# EAGLE design LED_power-supply (EAGLE 6.4)
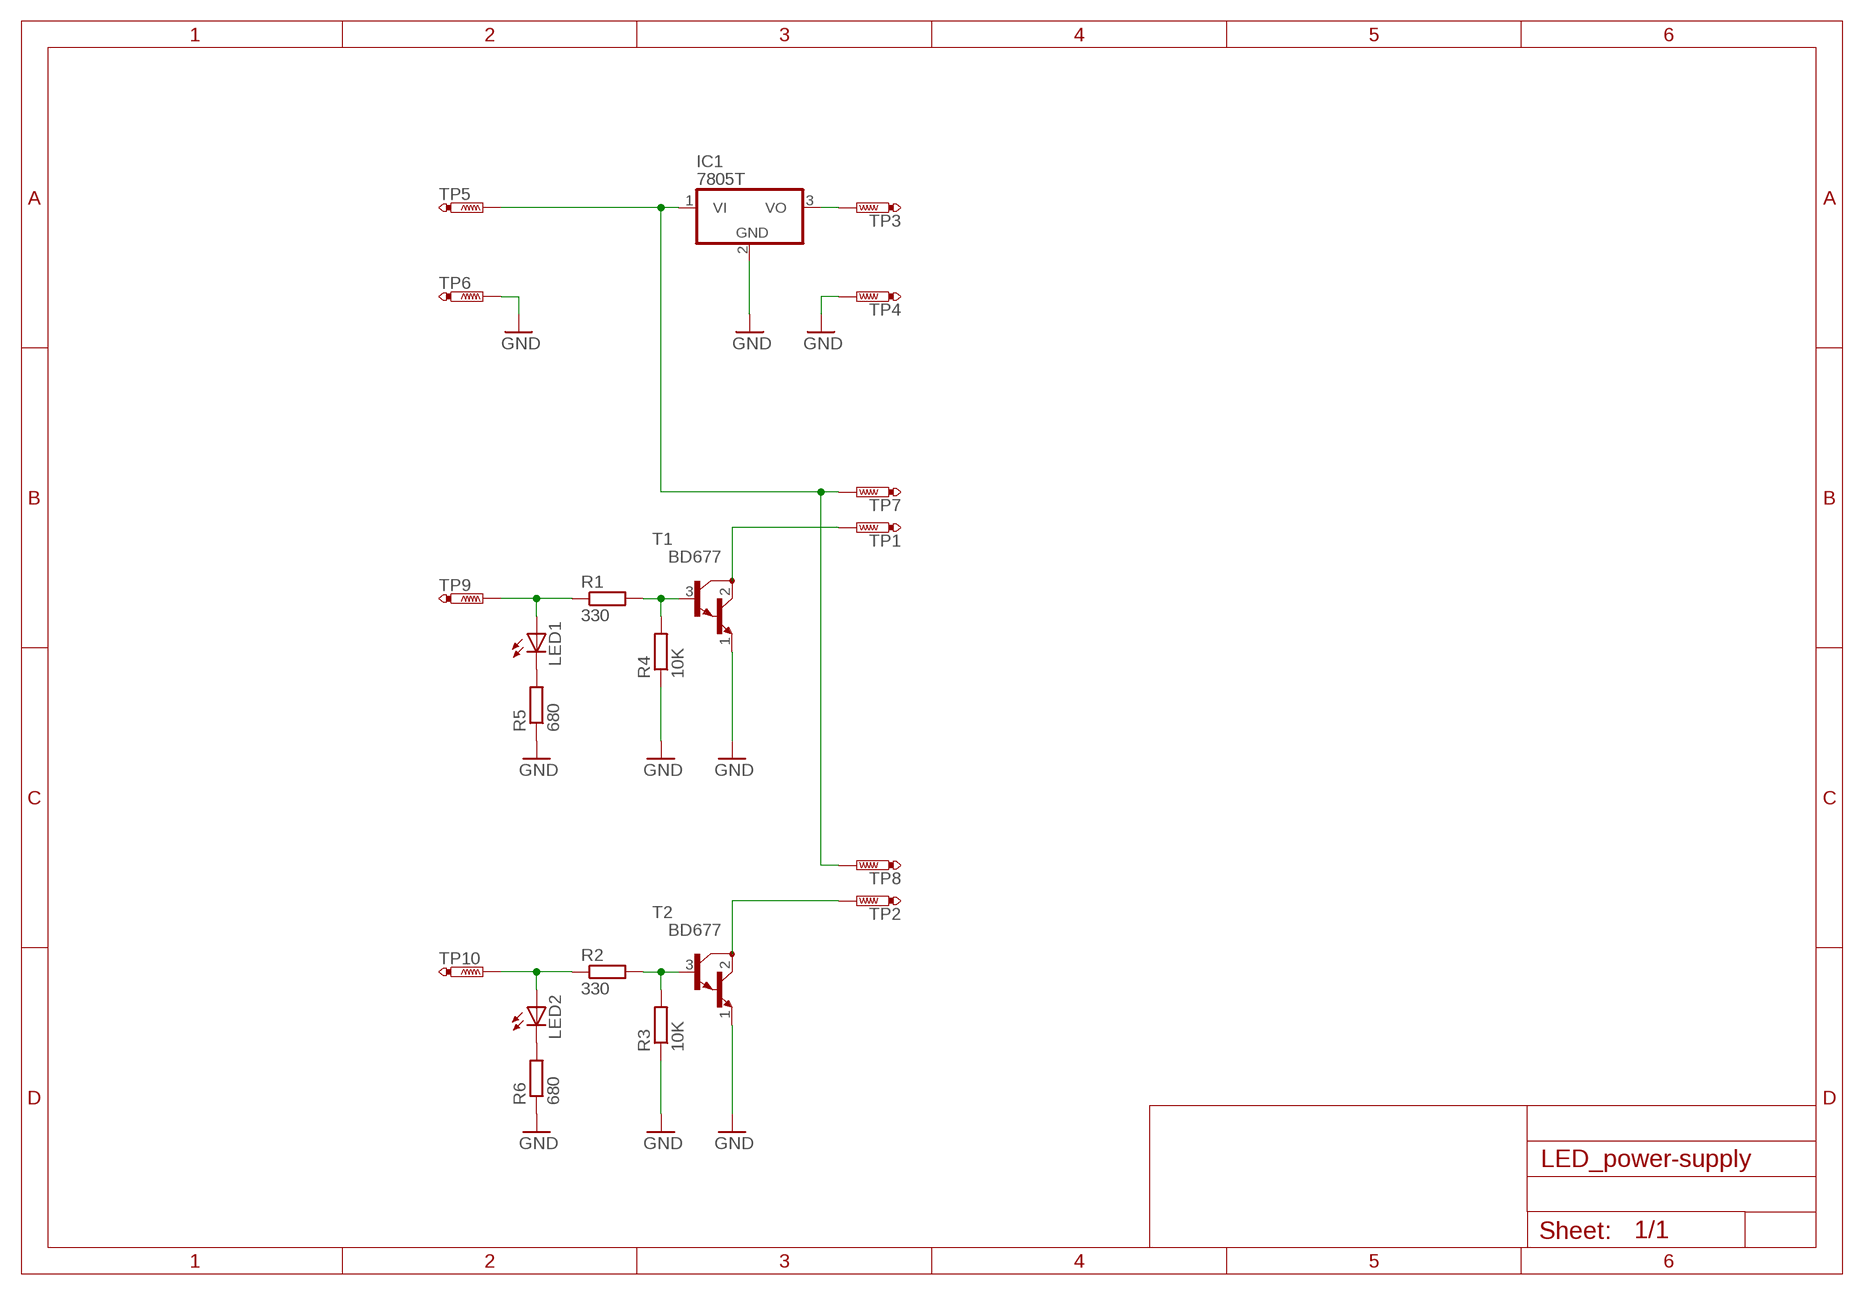
[diagram p0: schematic, sheet 1]

## Parts
IC1  7805T  [TO220H]
LED1  LED3MM  [LED3MM]
LED2  LED3MM  [LED3MM]
R1  330  R-EU_0207/10  [0207/10]
R2  330  R-EU_0207/10  [0207/10]
R3  10K  R-EU_0207/10  [0207/10]
R4  10K  R-EU_0207/10  [0207/10]
R5  680  R-EU_0207/10  [0207/10]
R6  680  R-EU_0207/10  [0207/10]
T1  BD677  [TO126]
T2  BD677  [TO126]
TP1  PTR1PAD1-17  [P1-17]
TP2  PTR1PAD1-17  [P1-17]
TP3  PTR1PAD1-17  [P1-17]
TP4  PTR1PAD1-17  [P1-17]
TP5  PTR1PAD1-17  [P1-17]
TP6  PTR1PAD1-17  [P1-17]
TP7  PTR1PAD1-17  [P1-17]
TP8  PTR1PAD1-17  [P1-17]
TP9  PTR1PAD1-17  [P1-17]
TP10  PTR1PAD1-17  [P1-17]

## Nets
GND: IC1.2(GND) R3.1 R4.1 R5.1 R6.1 T1.1(E) T2.1(E) TP4.TP TP6.TP
N$1: R1.2 R4.2 T1.3(B)
N$2: LED1.A R1.1 TP9.TP
N$3: T1.2(C) TP1.TP
N$4: R2.2 R3.2 T2.3(B)
N$5: LED2.A R2.1 TP10.TP
N$6: T2.2(C) TP2.TP
N$7: IC1.3(VO) TP3.TP
N$8: LED1.K(C) R5.2
N$9: IC1.1(VI) TP5.TP TP7.TP TP8.TP
N$10: LED2.K(C) R6.2

## Library data of the parts
IC1 = linear:78*: Positive VOLTAGE REGULATOR Source: http://cache.national.com/ds/LM/LM78L05.pdf http://www.fairchildsemi.com/ds/LM/LM7805.pdf
LED1 LED2 = led:LED: LED OSRAM: - CHIPLED LG R971, LG N971, LY N971, LG Q971, LY Q971, LO R971, LY R971 LH N974, LH R974 LS Q976, LO Q976, LY Q976 LO Q996 - Hyper CHIPLED LW Q18S LB Q993, LB Q99A, LB R99A - SideLED LS A670, LO A670, LY A670, LG A670, LP A670 LB A673, LV A673, LT A673, LW A673 LH A674 LY A675 LS A676, LA A676, LO A676, LY A676, LW A676 LS A679, LY A679, LG A679 - Hyper Micro SIDELED® LS Y876, LA Y876, LO Y876, LY Y876 LT Y87S - SmartLED LW L88C, LW L88S LB L89C, LB L89S, LG L890 LS L89K, LO L89K, LY L89K LS L896, LA L896, LO L896, LY L896 - TOPLED LS T670, LO T670, LY T670, LG T670, LP T670 LSG T670, LSP T670, LSY T670, LOP T670, LYG T670 LG T671, LOG T671, LSG T671 LB T673, LV T673, LT T673, LW T673 LH T674 LS T676, LA T676, LO T676, LY T676, LB T676, LH T676, LSB T676, LW T676 LB T67C, LV T67C, LT T67C, LS T67K, LO T67K, LY T67K, LW E67C LS E67B, LA E67B, LO E67B, LY E67B, LB E67C, LV E67C, LT E67C LW T67C LS T679, LY T679, LG T679 LS T770, LO T770, LY T770, LG T770, LP T770 LB T773, LV T773, LT T773, LW T773 LH T774 LS E675, LA E675, LY E675, LS T675 LS T776, LA T776, LO T776, LY T776, LB T776 LHGB T686 LT T68C, LB T68C - Hyper Mini TOPLED® LB M676 - Mini TOPLED Santana® LG M470 LS M47K, LO M47K, LY M47K Source: http://www.osram.convergy.de LUXEON: - LUMILED® LXK2-PW12-R00, LXK2-PW12-S00, LXK2-PW14-U00, LXK2-PW14-V00 LXK2-PM12-R00, LXK2-PM12-S00, LXK2-PM14-U00 LXK2-PE12-Q00, LXK2-PE12-R00, LXK2-PE12-S00, LXK2-PE14-T00, LXK2-PE14-U00 LXK2-PB12-K00, LXK2-PB12-L00, LXK2-PB12-M00, LXK2-PB14-N00, LXK2-PB14-P00, LXK2-PB14-Q00 LXK2-PR12-L00, LXK2-PR12-M00, LXK2-PR14-Q00, LXK2-PR14-R00 LXK2-PD12-Q00, LXK2-PD12-R00, LXK2-PD12-S00 LXK2-PH12-R00, LXK2-PH12-S00 LXK2-PL12-P00, LXK2-PL12-Q00, LXK2-PL12-R00 Source: www.luxeon.com KINGBRIGHT: KA-3528ASYC Source: www.kingbright.com
R1-R6 = rcl:R-EU_: RESISTOR, European symbol
T1 T2 = transistor:BD677: NPN BIPOLAR DARLINGTON TRANSISTOR
TP1-TP10 = testpad:PTR1: TEST PIN

## Board
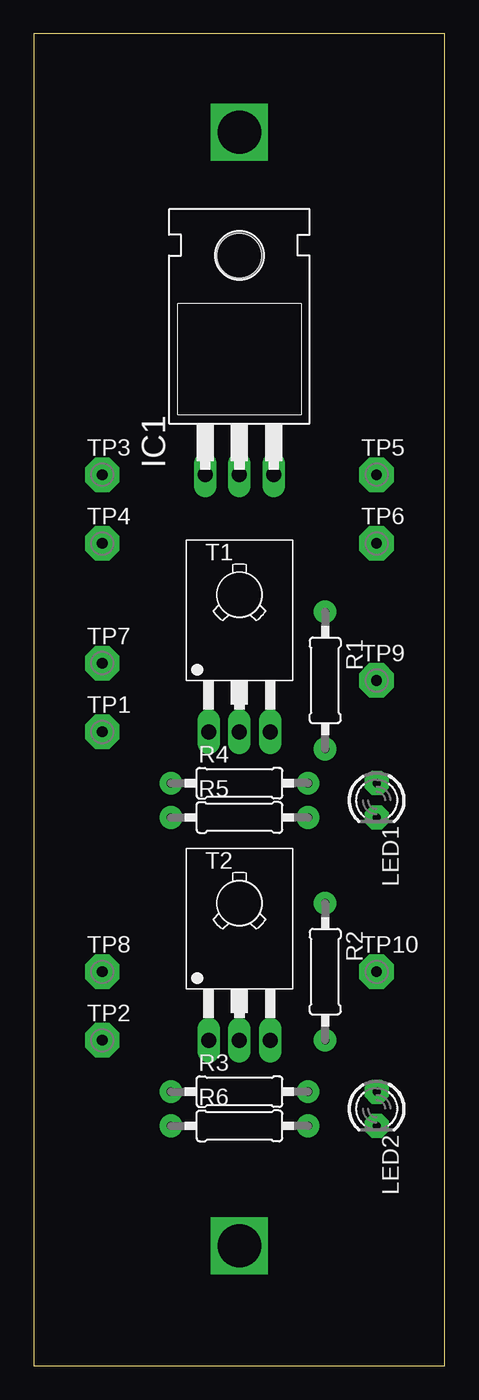
[diagram p1: board, top side]
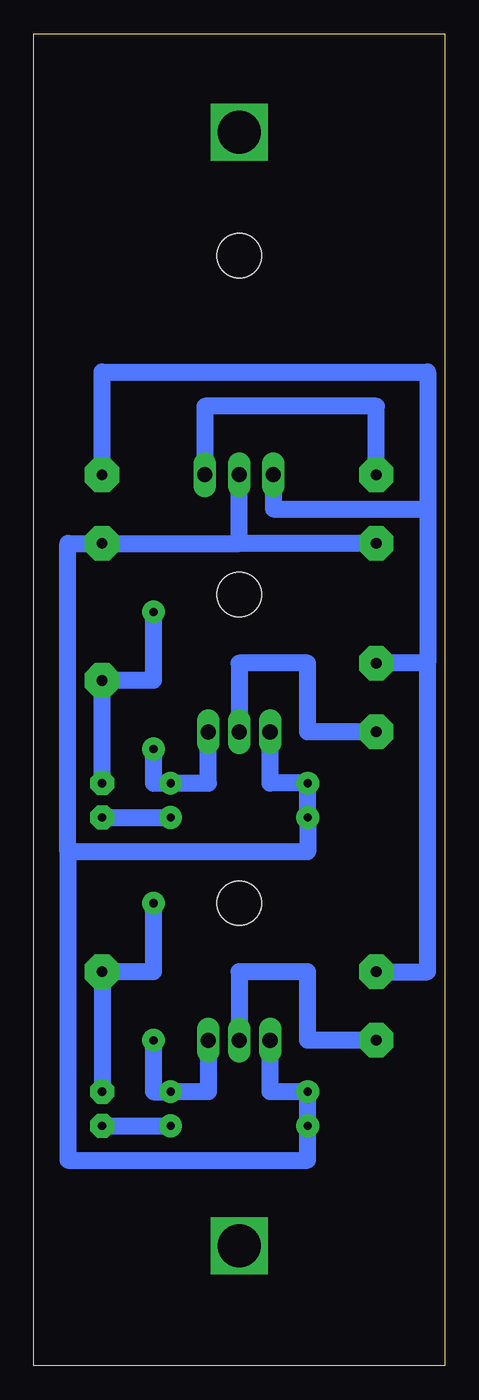
[diagram p2: board, bottom side, seen from below]

Size 30.46 x 98.73 mm. Coordinates in mm from the lower left corner, seen from the top.
Outline: 0,0 30.46,0 30.46,98.73 0,98.73 0,0
Copper layers (1*16): Top 0.035mm / dielectric 1.5mm / Bottom 0.035mm
Design rules "default": minimum track width 10mil, minimum drill 24mil, track to track 8mil, track to pad 8mil, pad to pad 8mil, via to via 8mil, smd to smd 8mil, copper to edge 40mil, drill to drill 8mil, minimum pad ring 10mil, minimum via ring 8mil, stop-mask expansion 4mil, vias tented up to drill 0mil, thermal gap 10mil

### Footprints (pad centres in the part's own frame; a part is rotated, then mirrored left to right if it is on the bottom)
TO220H = drill 1.118 long: 1 -2.54,-11.43; 2 0,-11.43; 3 2.54,-11.43 | hole 3.302: 0,4.826
LED3MM = drill 0.6 pad 1.778 octagon: A -1.27,0; K 1.27,0
0207/10 = drill 0.6 pad 1.676: 1 -5.08,0; 2 5.08,0
TO126 = drill 1.118 long: 1 -2.286,-5.08; 2 0,-5.08; 3 2.286,-5.08 | hole 3.302: 0,5.08
P1-17 = drill 0.8 pad 2.54 octagon: TP 0,0

### Placement (x,y rotation side)
IC1  15.24,77.47 0 top
LED1  25.4,41.91 270 top
LED2  25.4,19.05 270 top
R1  21.59,50.8 270 top
R2  21.59,29.21 270 top
R3  15.24,20.32 0 top
R4  15.24,43.18 0 top
R5  15.24,40.64 0 top
R6  15.24,17.78 0 top
T1  15.24,52.07 0 top
T2  15.24,29.21 0 top
TP1  5.08,46.99 0 top
TP2  5.08,24.13 0 top
TP3  5.08,66.04 0 top
TP4  5.08,60.96 0 top
TP5  25.4,66.04 0 top
TP6  25.4,60.96 0 top
TP7  5.08,52.07 0 top
TP8  5.08,29.21 0 top
TP9  25.4,50.8 0 top
TP10  25.4,29.21 0 top

### Tracks (layer width: path | path; a pad name or v marks a point on that pad's centre or on a via)
GND
  Bottom 1.27: TP4.TP 15.24,60.96 | 15.24,60.96 IC1.2 | 15.24,60.96 TP6.TP 27.94,60.96 27.94,38.1 | T1.1 12.95,43.18 R4.1 R5.1 10.16,38.1 27.94,38.1 | T2.1 12.95,20.32 R3.1 R6.1 10.16,15.24 27.94,15.24 27.94,38.1
N$1
  Bottom 1.27: T1.3 17.53,43.18 R4.2 21.59,43.18 R1.2
N$2
  Bottom 1.27: LED1.A TP9.TP 21.59,50.8 R1.1
N$3
  Bottom 1.27: TP1.TP 10.16,46.99 10.16,52.07 15.24,52.07 T1.2
N$4
  Bottom 1.27: T2.3 17.53,20.32 R3.2 21.59,20.32 R2.2
N$5
  Bottom 1.27: R2.1 21.59,29.21 TP10.TP LED2.A
N$6
  Bottom 1.27: TP2.TP 10.16,24.13 10.16,29.21 15.24,29.21 T2.2
N$7
  Bottom 1.27: TP3.TP 5.08,71.12 17.78,71.12 IC1.3
N$8
  Bottom 1.27: LED1.K R5.2
N$9
  Bottom 1.27: TP5.TP 25.4,73.66 1.27,73.66 1.27,63.5 | 1.27,63.5 1.27,52.07 | 1.27,52.07 TP7.TP | IC1.1 12.7,63.5 1.27,63.5 | TP8.TP 1.27,29.21 1.27,52.07
N$10
  Bottom 1.27: LED2.K R6.2
N$11  (via drill 3.2)
  other vias: 15.24,91.44
N$12  (via drill 3.2)
  other vias: 15.24,8.89